# Altium schematic sheet 6-gsm_ctrl.SchDoc
size B
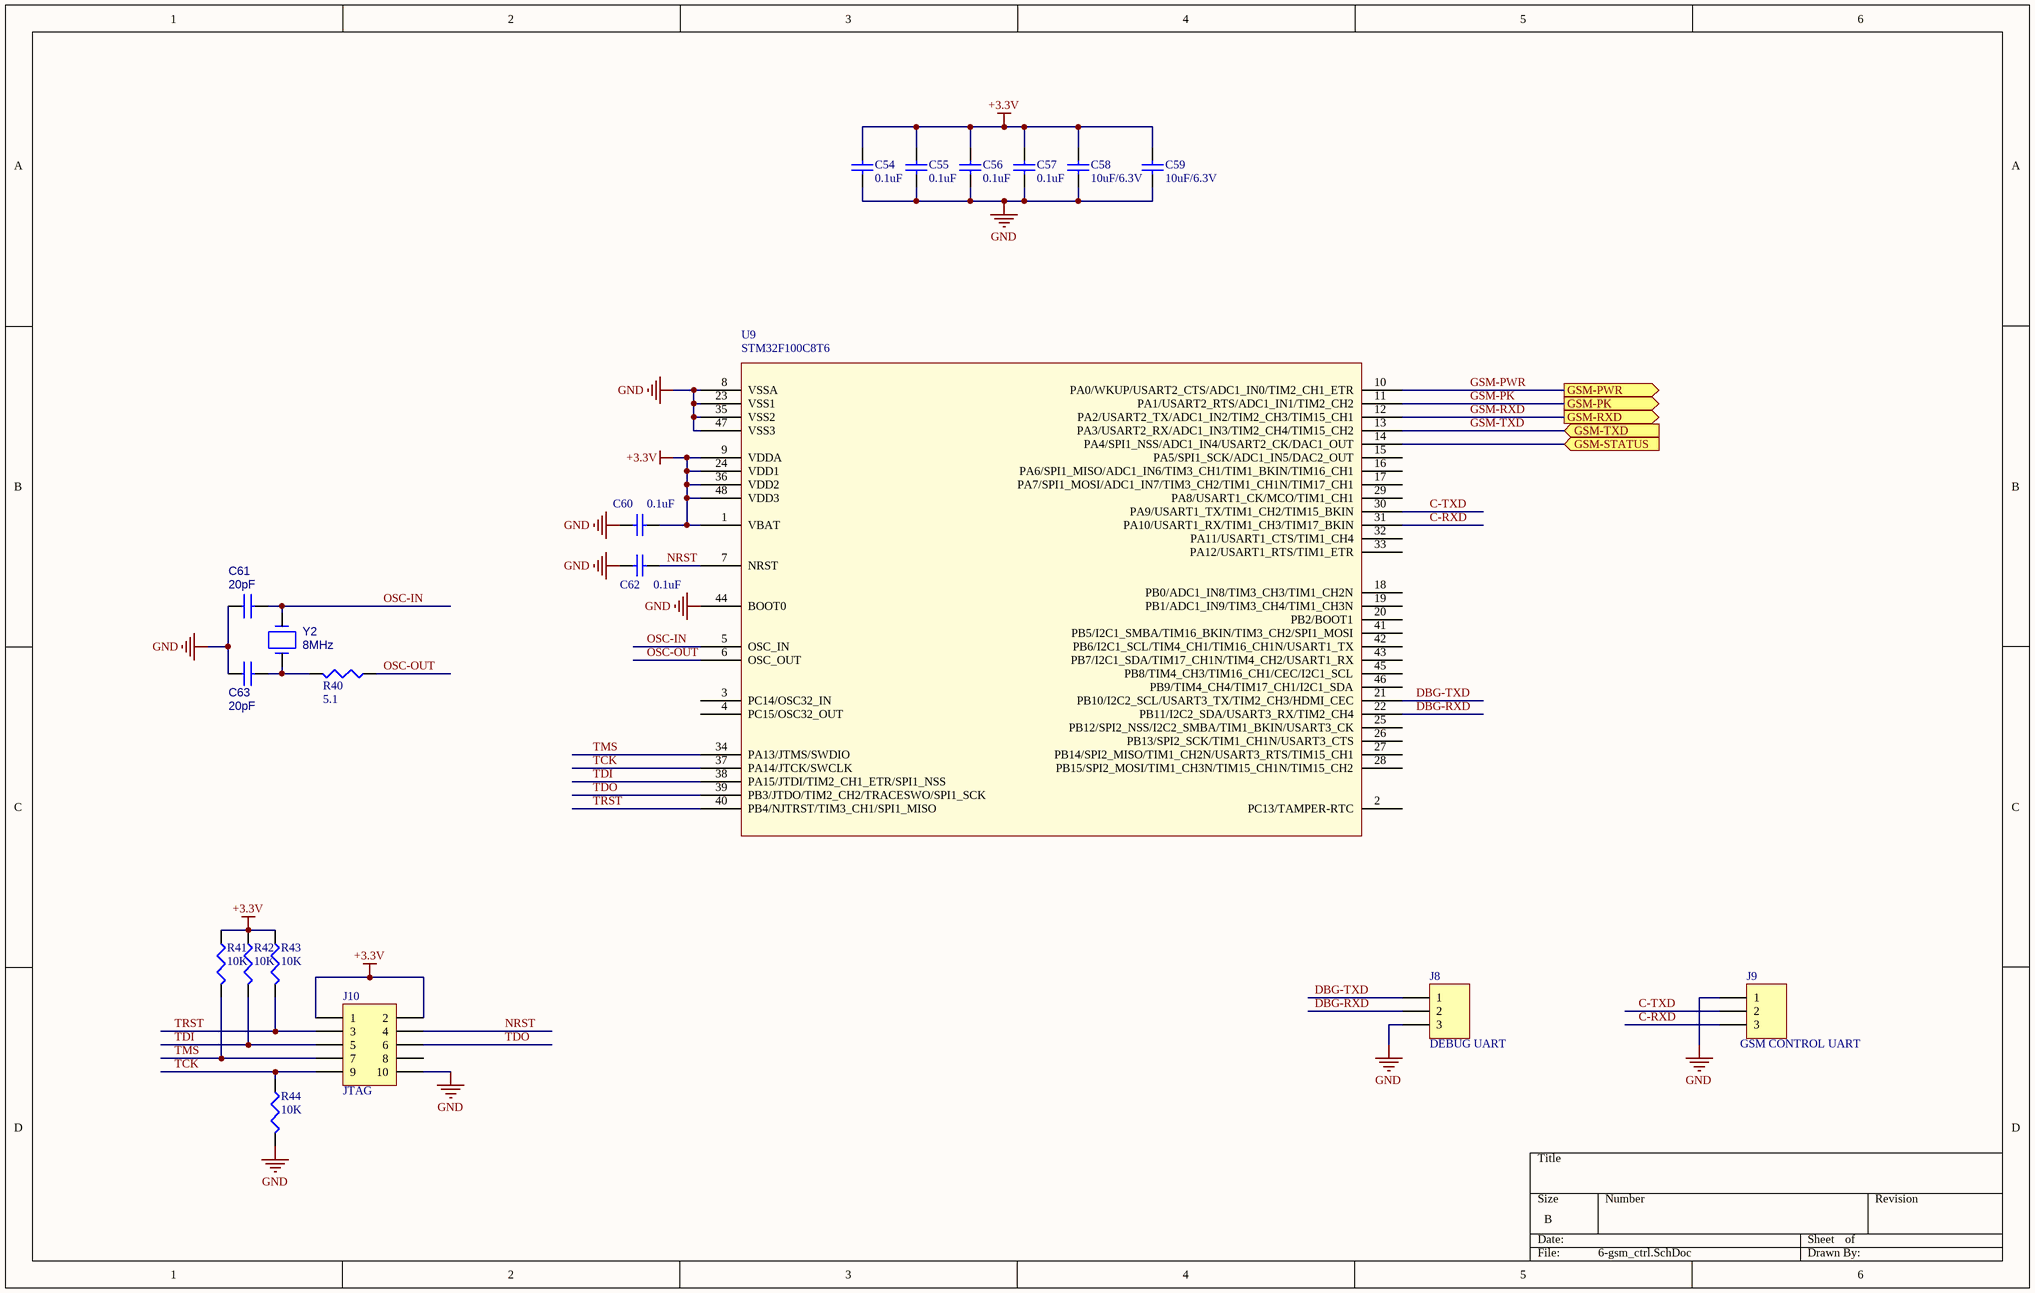
[diagram p0: 6-gsm_ctrl.SchDoc]

## Parts
C54  0.1uF  [0603]
C55  0.1uF  [0603]
C56  0.1uF  [0603]
C57  0.1uF  [0603]
C58  10uF/6.3V  [0805]
C59  10uF/6.3V  [0805]
C60  0.1uF  [0603]
C61  20pF  [0603]
C62  0.1uF  [0603]
C63  20pF  [0603]
J8  DEBUG UART  [HDR1X3]
J9  GSM CONTROL UART  [CONN-3P]
J10  JTAG  [HDR2X5]
R40  5.1  [0603]
R41  10K  [0603]
R42  10K  [0603]
R43  10K  [0603]
R44  10K  [0603]
U9  STM32F100C8T6  [LQFP48]
Y2  8MHz  [SMD-XTAL-5032]

## Ports
GSM-PK (out), GSM-PWR (out), GSM-RXD (out), GSM-STATUS (in), GSM-TXD (in)

## Nets
+3.3V: C54.1 C55.1 C56.1 C57.1 C58.1 C59.1 C60.1 J10.1 J10.2 R41.1 R42.1 R43.1 U9.1(VBAT) U9.9(VDDA) U9.24(VDD1) U9.36(VDD2) U9.48(VDD3)
GND: C54.2 C55.2 C56.2 C57.2 C58.2 C59.2 C60.2 C61.1 C62.1 C63.1 J8.3 J9.1 J10.10 R44.2 U9.8(VSSA) U9.23(VSS1) U9.35(VSS2) U9.44(BOOT0) U9.47(VSS3)
C-RXD: J9.3 U9.31(PA10/USART1_RX/TIM1_CH3/TIM17_BKIN)
C-TXD: J9.2 U9.30(PA9/USART1_TX/TIM1_CH2/TIM15_BKIN)
DBG-RXD: J8.2 U9.22(PB11/I2C2_SDA/USART3_RX/TIM2_CH4)
DBG-TXD: J8.1 U9.21(PB10/I2C2_SCL/USART3_TX/TIM2_CH3/HDMI_CEC)
GSM-PK: U9.11(PA1/USART2_RTS/ADC1_IN1/TIM2_CH2) ; port GSM-PK
GSM-PWR: U9.10(PA0/WKUP/USART2_CTS/ADC1_IN0/TIM2_CH1_ETR) ; port GSM-PWR
GSM-RXD: U9.12(PA2/USART2_TX/ADC1_IN2/TIM2_CH3/TIM15_CH1) ; port GSM-RXD
GSM-STATUS: U9.14(PA4/SPI1_NSS/ADC1_IN4/USART2_CK/DAC1_OUT) ; port GSM-STATUS
GSM-TXD: U9.13(PA3/USART2_RX/ADC1_IN3/TIM2_CH4/TIM15_CH2) ; port GSM-TXD
NRST: C62.2 J10.4 U9.7(NRST)
OSC-IN: C61.2 U9.5(OSC_IN) Y2.2
OSC-OUT: R40.1 U9.6(OSC_OUT)
TCK: J10.9 R44.1 U9.37(PA14/JTCK/SWCLK)
TDI: J10.5 R42.2 U9.38(PA15/JTDI/TIM2_CH1_ETR/SPI1_NSS)
TDO: J10.6 U9.39(PB3/JTDO/TIM2_CH2/TRACESWO/SPI1_SCK)
TMS: J10.7 R41.2 U9.34(PA13/JTMS/SWDIO)
TRST: J10.3 R43.2 U9.40(PB4/NJTRST/TIM3_CH1/SPI1_MISO)
NetC63_2: C63.2 R40.2 Y2.1

Not connected (* = marked no-connect by the designer): J10 8; U9 2(PC13/TAMPER-RTC) 3(PC14/OSC32_IN) 4(PC15/OSC32_OUT) 15(PA5/SPI1_SCK/ADC1_IN5/DAC2_OUT) 16(PA6/SPI1_MISO/ADC1_IN6/TIM3_CH1/TIM1_BKIN/TIM16_CH1) 17(PA7/SPI1_MOSI/ADC1_IN7/TIM3_CH2/TIM1_CH1N/TIM17_CH1) 18(PB0/ADC1_IN8/TIM3_CH3/TIM1_CH2N) 19(PB1/ADC1_IN9/TIM3_CH4/TIM1_CH3N) 20(PB2/BOOT1) 25(PB12/SPI2_NSS/I2C2_SMBA/TIM1_BKIN/USART3_CK) 26(PB13/SPI2_SCK/TIM1_CH1N/USART3_CTS) 27(PB14/SPI2_MISO/TIM1_CH2N/USART3_RTS/TIM15_CH1) 28(PB15/SPI2_MOSI/TIM1_CH3N/TIM15_CH1N/TIM15_CH2) 29(PA8/USART1_CK/MCO/TIM1_CH1) 32(PA11/USART1_CTS/TIM1_CH4) 33(PA12/USART1_RTS/TIM1_ETR) 41(PB5/I2C1_SMBA/TIM16_BKIN/TIM3_CH2/SPI1_MOSI) 42(PB6/I2C1_SCL/TIM4_CH1/TIM16_CH1N/USART1_TX) 43(PB7/I2C1_SDA/TIM17_CH1N/TIM4_CH2/USART1_RX) 45(PB8/TIM4_CH3/TIM16_CH1/CEC/I2C1_SCL) 46(PB9/TIM4_CH4/TIM17_CH1/I2C1_SDA)

## Library data of the parts
C54-C57 C60 C62 = Cap: Capacitor; Published: 8-Jun-2000; LatestRevisionDate: 17-Jul-2002; LatestRevisionNote: Re-released for DXP Platform.; PackageReference: RAD-0.3; Publisher: Altium Limited; PackageDescription: Radial Cap, Thru-Hole; 2 Leads; 0.3 in Pin Spacing; Value: 0.1uF
C58 C59 = Cap: Capacitor; Value: 0.1uF; Published: 8-Jun-2000; LatestRevisionDate: 17-Jul-2002; LatestRevisionNote: Re-released for DXP Platform.; PackageReference: RAD-0.3; Publisher: Altium Limited; PackageDescription: Radial Cap, Thru-Hole; 2 Leads; 0.3 in Pin Spacing
C61 C63 = CAP_Dup1
J8 J9 = Header 3: Header, 3-Pin; LatestRevisionDate: 17-Jul-2002; LatestRevisionNote: Re-released for DXP Platform.; Publisher: Altium Limited
J10 = Header 5X2: Header, 5-Pin, Dual row; LatestRevisionDate: 17-Jul-2002; LatestRevisionNote: Re-released for DXP Platform.; Publisher: Altium Limited
R40-R44 = Res3: Resistor; Value: 0.1/1W; Published: 8-Jun-2000; LatestRevisionDate: 29-May-2009; LatestRevisionNote: IPC-7351 Footprint Added.; PackageReference: J1-0603; Publisher: Altium Limited; PackageDescription: Chip Resistor
U9 = STM32F100XX-LQFP48
Y2 = CRYSTAL